# EAGLE design v1 (EAGLE 7.6.0)
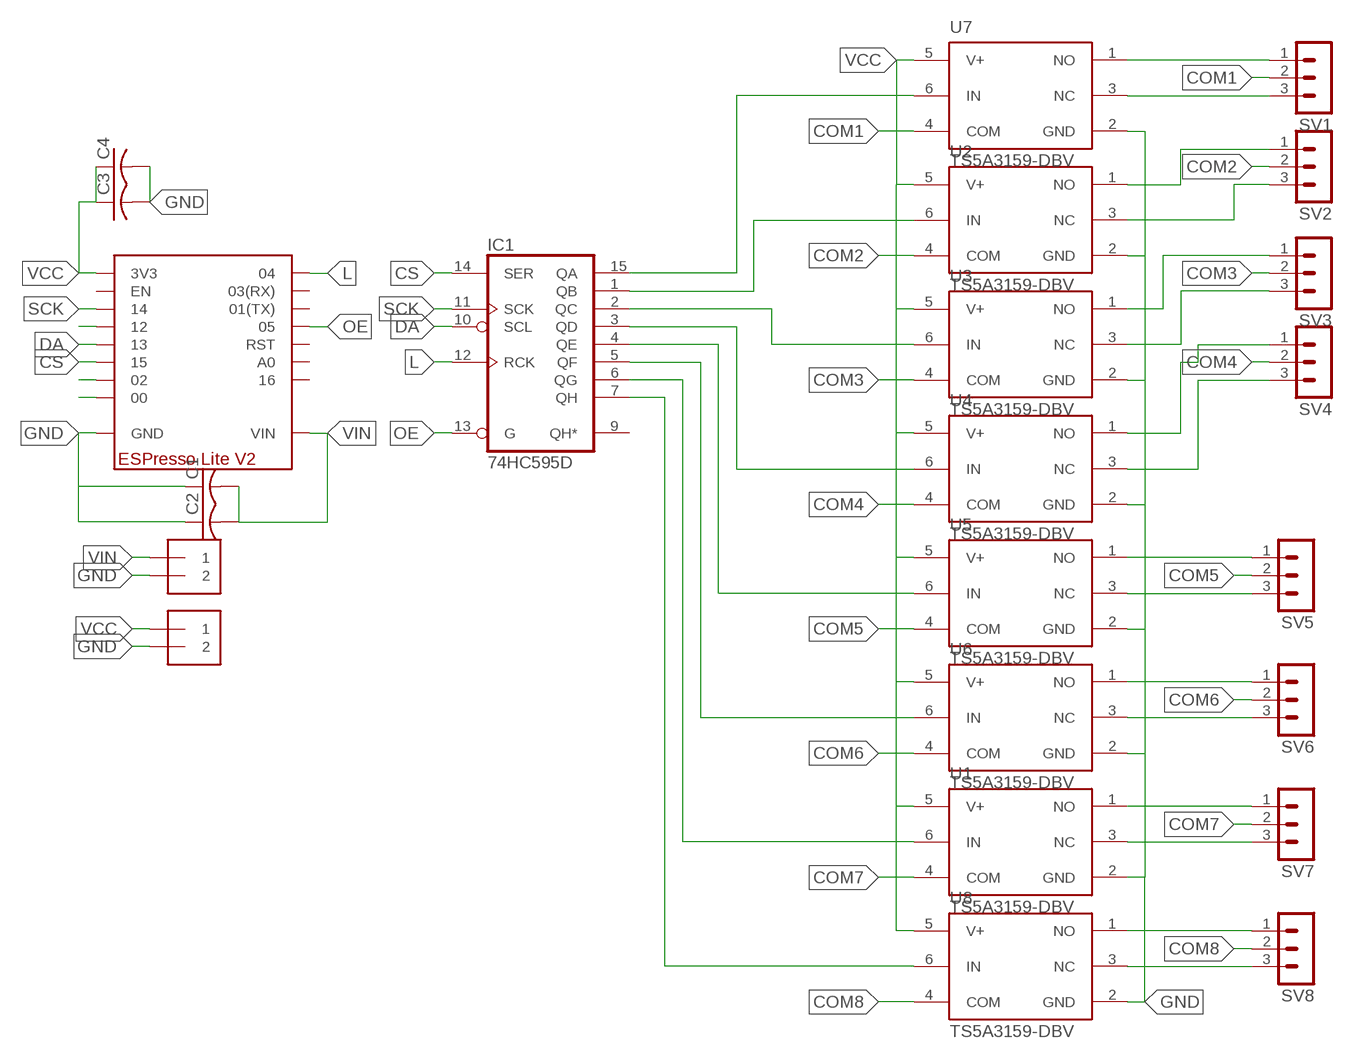
[diagram p0: schematic, sheet 1]

## Parts
C1  C-USC0805  [C0805]
C2  C-USC0805  [C0805]
C3  C-USC0805  [C0805]
C4  C-USC0805  [C0805]
IC1  74HC595D  [SO16]
J1  1X2-3.5MM  [1X2-3.5MM]
J2  1X2-3.5MM  [1X2-3.5MM]
SV1  MA03-1  [MA03-1]
SV2  MA03-1  [MA03-1]
SV3  MA03-1  [MA03-1]
SV4  MA03-1  [MA03-1]
SV5  MA03-1  [MA03-1]
SV6  MA03-1  [MA03-1]
SV7  MA03-1  [MA03-1]
SV8  MA03-1  [MA03-1]
U1  TS5A3159-DBV  [SOT23-6L]
U2  TS5A3159-DBV  [SOT23-6L]
U3  TS5A3159-DBV  [SOT23-6L]
U4  TS5A3159-DBV  [SOT23-6L]
U5  TS5A3159-DBV  [SOT23-6L]
U6  TS5A3159-DBV  [SOT23-6L]
U7  TS5A3159-DBV  [SOT23-6L]
U8  TS5A3159-DBV  [SOT23-6L]
U$1  ESPRESSO-LITE-V2  [ESPRESSO-LITE-V2]

## Nets
COM1: SV1.2 U7.4(COM)
COM2: SV2.2 U2.4(COM)
COM3: SV3.2 U3.4(COM)
COM4: SV4.2 U4.4(COM)
COM5: SV5.2 U5.4(COM)
COM6: SV6.2 U6.4(COM)
COM7: SV7.2 U1.4(COM)
COM8: SV8.2 U8.4(COM)
CS: IC1.14(SER) U$1.15
DA: IC1.10(SCL) U$1.13
GND: C1.1 C2.1 C3.2 C4.2 J1.2 J2.2 U1.2(GND) U2.2(GND) U3.2(GND) U4.2(GND) U5.2(GND) U6.2(GND) U7.2(GND) U8.2(GND) U$1.GND1(GND) U$1.GND2(GND) U$1.GND3(GND)
L: IC1.12(RCK) U$1.04
N$3: SV3.3 U3.3(NC)
N$4: SV1.1 U7.1(NO)
N$5: SV1.3 U7.3(NC)
N$6: SV2.1 U2.1(NO)
N$7: SV2.3 U2.3(NC)
N$8: SV3.1 U3.1(NO)
N$9: SV4.1 U4.1(NO)
N$10: SV4.3 U4.3(NC)
N$11: SV5.1 U5.1(NO)
N$12: SV5.3 U5.3(NC)
N$13: SV6.1 U6.1(NO)
N$14: SV6.3 U6.3(NC)
N$15: SV7.1 U1.1(NO)
N$16: SV7.3 U1.3(NC)
N$17: SV8.1 U8.1(NO)
N$18: SV8.3 U8.3(NC)
N$19: IC1.7(QH) U8.6(IN)
N$20: IC1.6(QG) U1.6(IN)
N$21: IC1.5(QF) U6.6(IN)
N$22: IC1.4(QE) U5.6(IN)
N$23: IC1.3(QD) U4.6(IN)
N$24: IC1.2(QC) U3.6(IN)
N$25: IC1.1(QB) U2.6(IN)
N$26: IC1.15(QA) U7.6(IN)
N$28: U$1.12
N$34: U$1.02
N$35: U$1.00
OE: IC1.13(G) U$1.05
SCK: IC1.11(SCK) U$1.14
VCC: C3.1 C4.1 J2.1 U1.5(V+) U2.5(V+) U3.5(V+) U4.5(V+) U5.5(V+) U6.5(V+) U7.5(V+) U8.5(V+) U$1.3V3
VIN: C1.2 C2.2 J1.1 U$1.VIN1(VIN) U$1.VIN2(VIN)
Unconnected: IC1.9(QH*) U$1.01(01(TX)) U$1.03(03(RX)) U$1.16 U$1.AO(A0) U$1.EN U$1.RST

## Power pins joined to a net without a drawn wire
GND: IC1.8(GND)
VCC: IC1.16(VCC)

## Library data of the parts
C1-C4 = adafruit:C-US: CAPACITOR, American symbol
IC1 = 74xx-eu:74*595: 8-bit SHIFT REGISTER, output latch
J1 J2 = adafruit:1X2: 3.5mm Terminal block http://www.ladyada.net/library/pcb/eaglelibrary.html
SV1-SV8 = con-lstb:MA03-1: PIN HEADER; OC_FARNELL: unknown; OC_NEWARK: unknown
U1-U8 = m-pad-2.1:TS5A3159: Ti's TS5A3159 1 Ohm single-pole double-throw (SPDT) analog switch Description: The TS5A3159 is a single-pole double-throw (SPDT) analog switch that is designed to operate from 1.65 V to 5.5 V. The device offers a low ON-state resistance and an excellent ON-resistance, matching with the break-before-make feature to prevent signal distortion during the transferring of a signal from one channel to another. The device has an excellent total harmonic distortion (THD) performance and consumes very low power. These features make this device suitable for portable audio applications. Features: Specified Break-Before-Make Switching Low ON-State Resistance (1 ) Control Inputs Are 5-V Tolerant Low Charge Injection Excellent ON-Resistance Matching Low Total Harmonic Distortion 1.65-V to 5.5-V Single-Supply Operation Latch-Up Performance Exceeds 100 mA Per JESD 78, Class II ESD Performance Tested Per JESD 22 - 2000-V Human-Body Model (A114-B, Class II) - 1000-V Charged-Device Model (C101) Applications: Cell Phones PDAs Portable Instrumentation Please send any comments to: messi@users.sourceforge.net
U$1 = cmmc_lbr1:ESPRESSO-LITE-V2

## Board
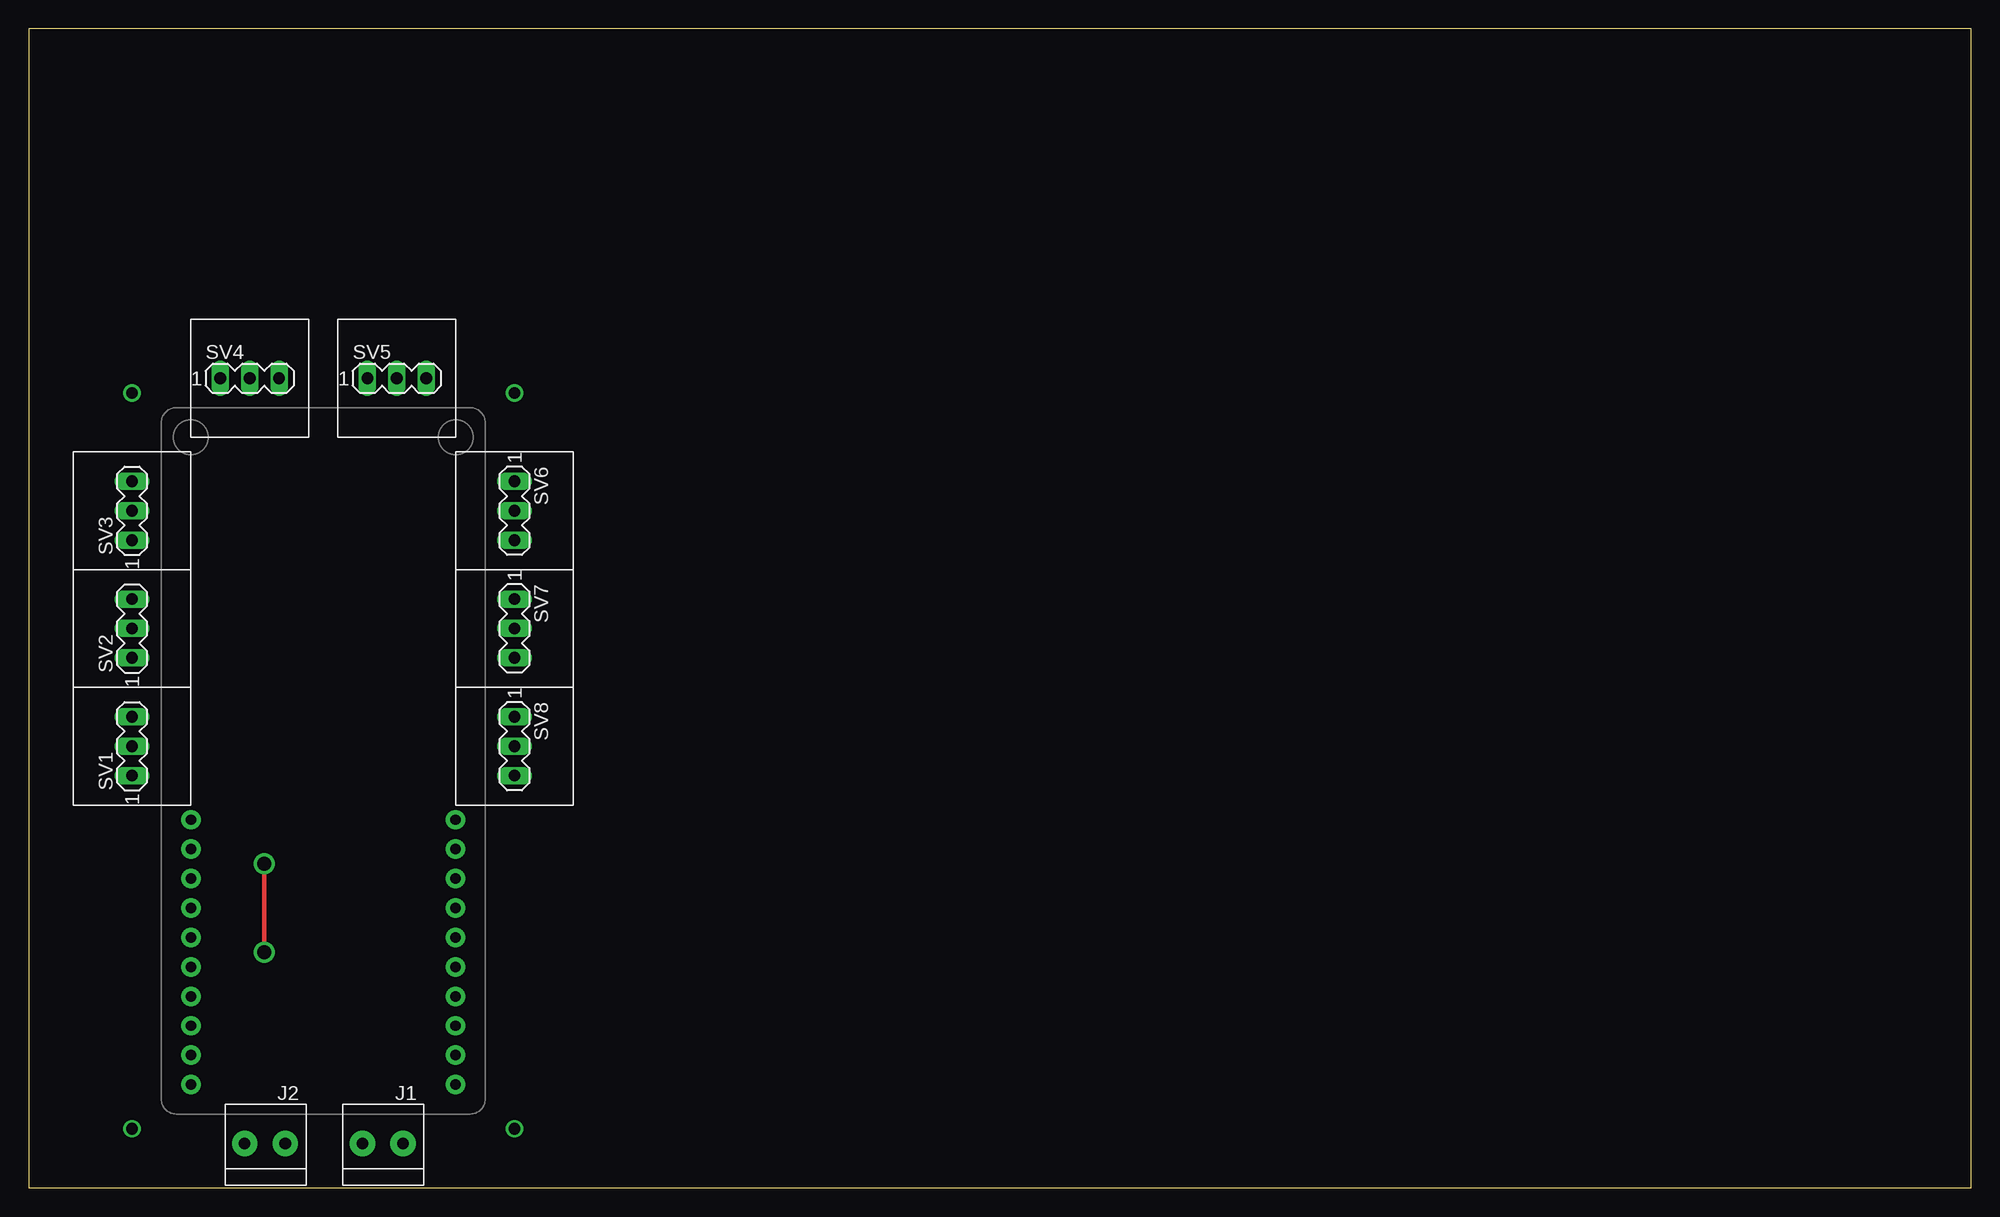
[diagram p1: board, top side]
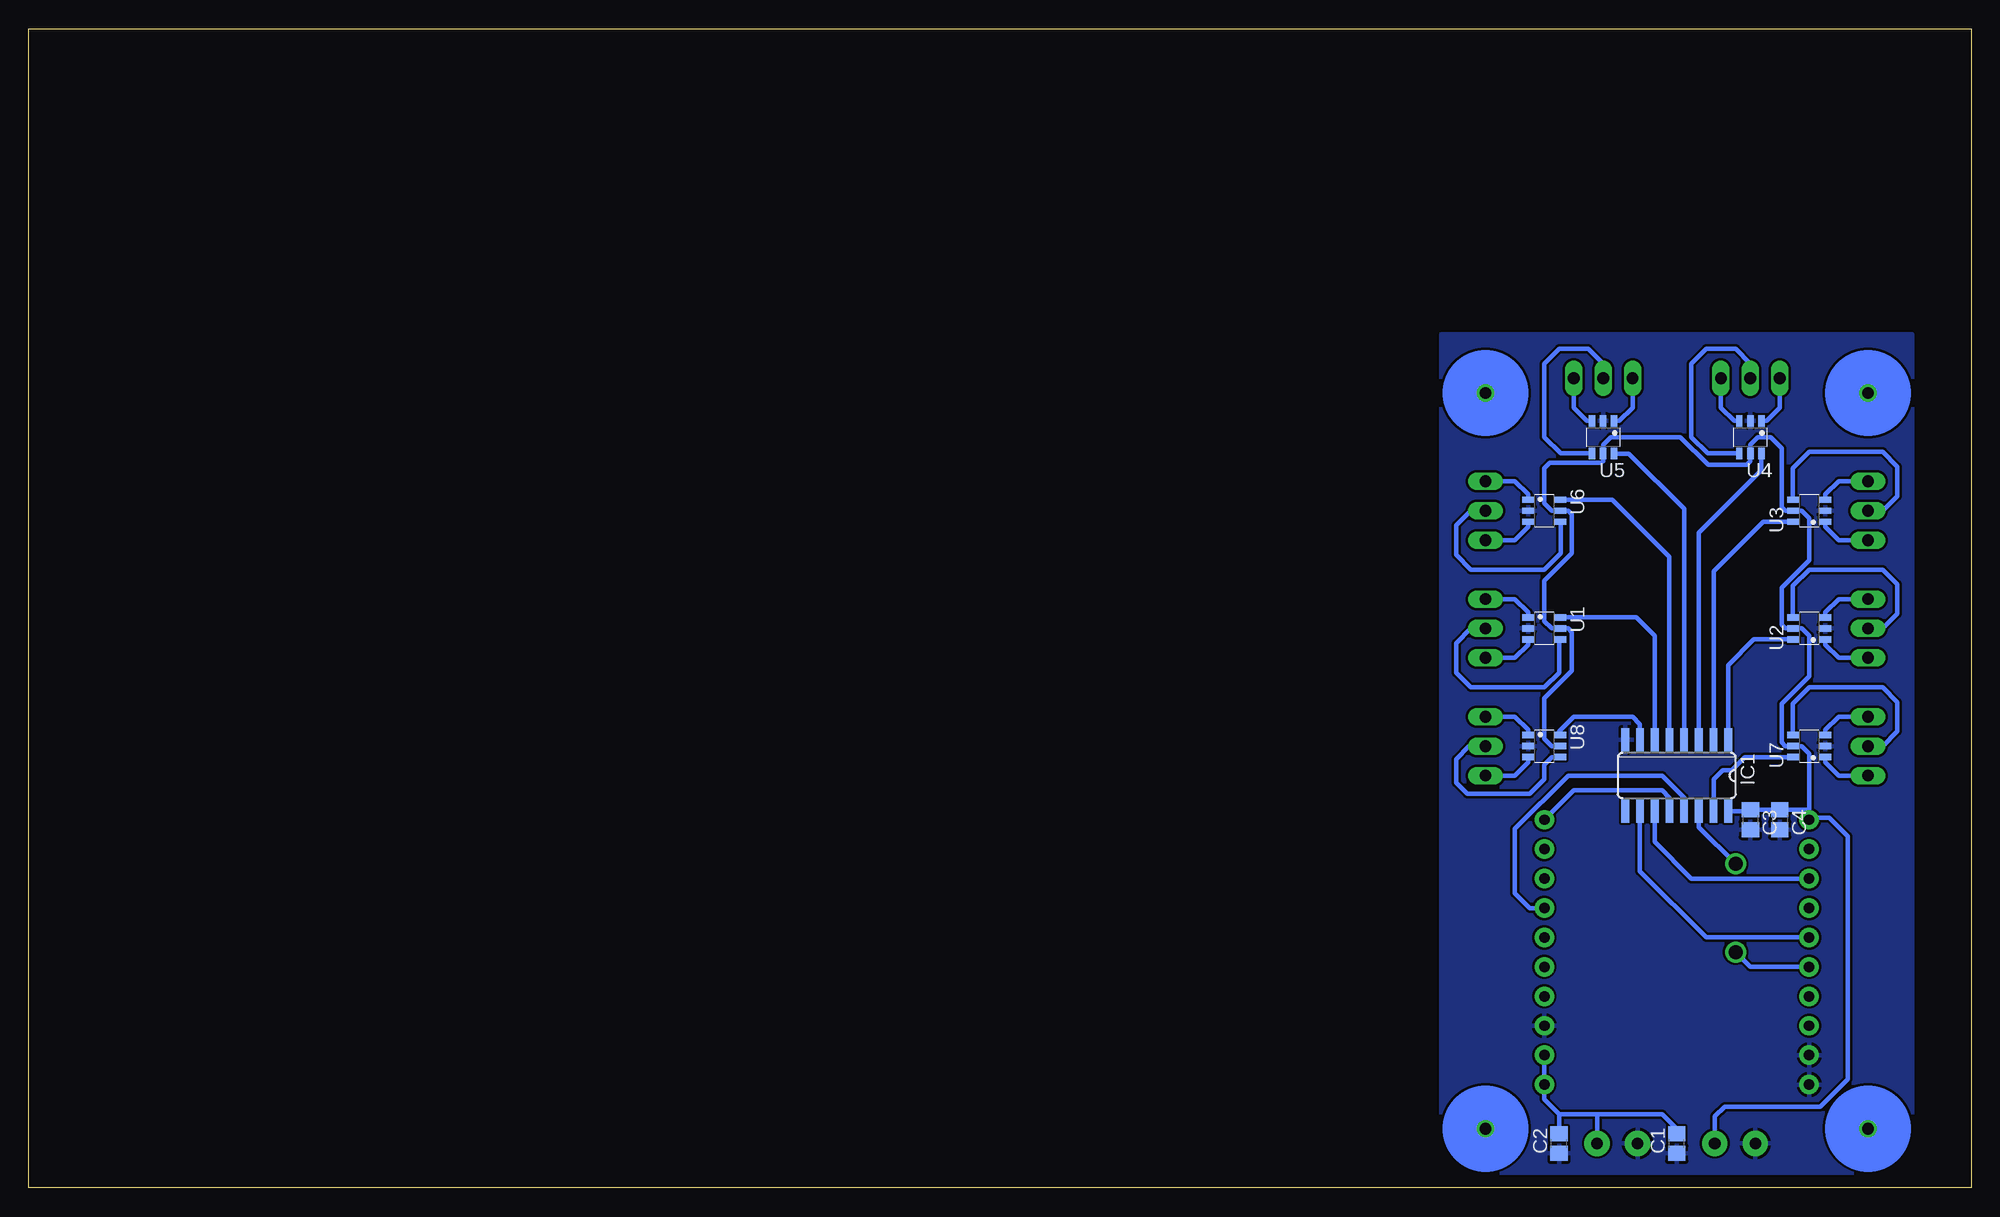
[diagram p2: board, bottom side, seen from below]

Size 167.62 x 100 mm. Coordinates in mm from the lower left corner, seen from the top.
Outline: 0,0 167.62,0 167.62,100 0,100 0,0
Copper layers (1*16): Top 0.035mm / dielectric 1.5mm / Bottom 0.035mm
Design rules "default": minimum track width 10mil, minimum drill 24mil, track to track 8mil, track to pad 8mil, pad to pad 8mil, via to via 8mil, smd to smd 8mil, copper to edge 40mil, drill to drill 8mil, minimum pad ring 10mil, minimum via ring 8mil, stop-mask expansion 4mil, vias tented up to drill 0mil, thermal gap 10mil

### Footprints (pad centres in the part's own frame; a part is rotated, then mirrored left to right if it is on the bottom)
C0805 = smd 1.3 x 1.5: 1 -0.85,0; 2 0.85,0
SO16 = smd 0.66 x 2.032: 1 -4.445,-3.073; 2 -3.175,-3.073; 3 -1.905,-3.073; 4 -0.635,-3.073; 5 0.635,-3.073; 6 1.905,-3.073; 7 3.175,-3.073; 8 4.445,-3.073; 9 4.445,3.073; 10 3.175,3.073; 11 1.905,3.073; 12 0.635,3.073; 13 -0.635,3.073; 14 -1.905,3.073; 15 -3.175,3.073; 16 -4.445,3.073
1X2-3.5MM = drill 1 pad 2.184: 1 1.8,0; 2 -1.7,0
MA03-1 = drill 1.016 long: 1 -2.54,0; 2 0,0; 3 2.54,0
SOT23-6L = smd 0.55 x 1: 1 -0.95,-1.4; 2 0,-1.4; 3 0.95,-1.4; 4 0.95,1.4; 5 0,1.4; 6 -0.95,1.4
ESPRESSO-LITE-V2 = drill 0.9 pad 1.676: 00 2.54,7.62; 01 25.4,20.32; 02 2.54,10.16; 03 25.4,22.86; 3V3 2.54,25.4; 04 25.4,25.4; 05 25.4,17.78; 12 2.54,17.78; 13 2.54,15.24; 14 2.54,20.32; 15 2.54,12.7; 16 25.4,10.16; AO 25.4,12.7; EN 2.54,22.86; GND1 2.54,2.54; GND2 2.54,5.08; GND3 25.4,7.62; RST 25.4,15.24; VIN1 25.4,2.54; VIN2 25.4,5.08

### Placement (x,y rotation side)
C1  25.4,3.81 90 bottom
C2  35.56,3.81 90 bottom
C3  19.05,31.75 270 bottom
C4  16.51,31.75 270 bottom
IC1  25.4,35.56 180 bottom
J1  30.48,3.81 0 top
J2  20.32,3.81 0 top
SV1  8.89,38.1 90 top
SV2  8.89,48.26 90 top
SV3  8.89,58.42 90 top
SV4  19.05,69.85 0 top
SV5  31.75,69.85 0 top
SV6  41.91,58.42 270 top
SV7  41.91,48.26 270 top
SV8  41.91,38.1 270 top
U1  36.83,48.26 270 bottom
U2  13.97,48.26 90 bottom
U3  13.97,58.42 90 bottom
U4  19.05,64.77 180 bottom
U5  31.75,64.77 180 bottom
U6  36.83,58.42 270 bottom
U7  13.97,38.1 90 bottom
U8  36.83,38.1 270 bottom
U$1  11.43,6.35 0 top

### Tracks (layer width: path | path; a pad name or v marks a point on that pad's centre or on a via)
COM1
  Bottom 0.406: U7.4 15.37,41.78 13.97,43.18 7.62,43.18 6.35,41.91 6.35,39.37 7.62,38.1 SV1.2
COM2
  Bottom 0.406: U2.4 15.37,51.94 13.97,53.34 7.62,53.34 6.35,52.07 6.35,49.53 7.62,48.26 SV2.2
COM3
  Bottom 0.406: U3.4 15.37,62.1 13.97,63.5 7.62,63.5 6.35,62.23 6.35,59.69 7.62,58.42 SV3.2
COM4
  Bottom 0.406: U4.4 22.73,63.37 24.13,64.77 24.13,71.12 22.86,72.39 20.32,72.39 19.05,71.12 SV4.2
COM5
  Bottom 0.406: U5.4 35.43,63.37 36.83,64.77 36.83,71.12 35.56,72.39 33.02,72.39 31.75,71.12 SV5.2
COM6
  Bottom 0.406: U6.4 35.43,54.74 36.83,53.34 43.18,53.34 44.45,54.61 44.45,57.15 43.18,58.42 SV6.2
COM7
  Bottom 0.406: SV7.2 43.18,48.26 44.45,46.99 44.45,44.45 43.18,43.18 36.83,43.18 35.56,44.45 35.56,47.18 U1.4
COM8
  Bottom 0.406: U8.4 36.19,37.15 36.83,36.51 36.83,35.24 38.1,33.97 43.5,33.97 44.45,34.92 44.45,36.99 43.34,38.1 SV8.2
CS  (via drill 1.2)
  Top 0.406: v20.32,27.94 v20.32,20.32
  Bottom 0.406: IC1.14 23.5,31.11 v20.32,27.94 | U$1.15 19.05,19.05 v20.32,20.32
DA
  Bottom 0.406: IC1.10 28.57,27.3 22.86,21.59 U$1.13
GND
  pour Bottom: 5.08,1.27 5.08,73.66 45.72,73.66 45.72,1.27
L
  Bottom 0.406: IC1.12 26.04,33.66 26.67,34.29 34.29,34.29 U$1.04
N$3
  Bottom 0.406: U3.3 12.57,59.82 11.43,60.96 SV3.3
N$4
  Bottom 0.406: U7.1 12.57,36.7 11.43,35.56 SV1.1
N$5
  Bottom 0.406: U7.3 12.57,39.5 11.43,40.64 SV1.3
N$6
  Bottom 0.406: U2.1 12.57,46.86 11.43,45.72 SV2.1
N$7
  Bottom 0.406: U2.3 12.57,49.66 11.43,50.8 SV2.3
N$8
  Bottom 0.406: U3.1 12.57,57.02 11.43,55.88 SV3.1
N$9
  Bottom 0.406: U4.1 17.65,66.17 16.51,67.31 SV4.1
N$10
  Bottom 0.406: U4.3 20.45,66.17 21.59,67.31 SV4.3
N$11
  Bottom 0.406: U5.1 30.35,66.17 29.21,67.31 SV5.1
N$12
  Bottom 0.406: U5.3 33.15,66.17 34.29,67.31 SV5.3
N$13
  Bottom 0.406: U6.1 38.23,59.82 39.37,60.96 SV6.1
N$14
  Bottom 0.406: U6.3 38.23,57.02 39.37,55.88 SV6.3
N$15
  Bottom 0.406: U1.1 38.23,49.66 39.37,50.8 SV7.1
N$16
  Bottom 0.406: U1.3 38.23,46.86 39.37,45.72 SV7.3
N$17
  Bottom 0.406: U8.1 38.23,39.5 39.37,40.64 SV8.1
N$18
  Bottom 0.406: U8.3 38.23,36.7 39.37,35.56 SV8.3
N$19
  Bottom 0.406: IC1.7 28.57,40.01 29.21,40.64 34.29,40.64 35.56,39.37 35.56,39.18 U8.6
N$20
  Bottom 0.406: U1.6 28.89,49.21 27.3,47.62 IC1.6
N$21
  Bottom 0.406: IC1.5 26.04,54.45 30.96,59.37 U6.6
N$22
  Bottom 0.406: IC1.4 24.77,58.58 29.53,63.34 30.77,63.34 U5.6
N$23
  Bottom 0.406: IC1.3 23.5,56.52 18.1,61.91 U4.6
N$24
  Bottom 0.406: IC1.2 22.23,53.18 17.94,57.47 U3.6
N$25
  Bottom 0.406: IC1.1 20.96,45.09 18.73,47.31 U2.6
N$26
  Bottom 0.406: U7.6 19.52,37.15 20.64,36.04 21.43,36.04 22.23,35.24 IC1.15
N$27  (via drill 1)
  other vias: 41.91,5.08
N$29  (via drill 1)
  other vias: 8.89,5.08
N$30  (via drill 1)
  other vias: 41.91,68.58
N$31  (via drill 1)
  other vias: 8.89,68.58
OE
  Bottom 0.406: IC1.13 24.77,33.66 26.67,35.56 34.77,35.56 39.37,30.96 39.37,25.4 38.1,24.13 U$1.05
SCK
  Bottom 0.406: IC1.11 27.3,29.84 24.13,26.67 U$1.14
VCC
  Bottom 0.406: U8.5 36.2,38.1 36.83,38.73 36.83,42.23 34.45,44.61 34.45,47.94 34.77,48.26 U1.5 36.2,48.26 36.83,48.9 36.83,52.39 34.45,54.77 34.45,58.1 34.77,58.42 U6.5 36.2,58.42 36.83,59.05 36.83,62.07 36.35,62.55 31.91,62.55 31.75,62.71 U5.5 31.75,64.14 31.12,64.77 25.08,64.77 22.7,62.39 19.37,62.39 19.05,62.71 U4.5 19.05,64.14 18.41,64.77 17.3,64.77 16.35,63.82 16.35,58.74 16.03,58.42 U3.5 14.61,58.42 13.97,57.78 13.97,54.13 16.35,51.75 16.35,48.58 16.03,48.26 U2.5 14.61,48.26 13.97,47.62 13.97,44.13 16.35,41.75 16.35,38.42 16.03,38.1 U7.5 14.61,38.1 13.97,37.47 13.97,32.54 | 13.97,32.54 U$1.3V3 13.81,31.91 12.22,31.91 10.64,30.32 10.64,9.37 13.02,6.99 21.27,6.99 22.12,6.14 J2.1 | IC1.16 19.16,32.49 C3.1 C4.1 14.03,32.6 13.97,32.54
VIN
  Bottom 0.406: C1.2 25.4,5.08 26.67,6.35 31.75,6.35 32.28,6.35 | 35.56,6.35 36.83,7.62 U$1.VIN1 U$1.VIN2 | C2.2 35.56,6.35 | 35.56,6.35 32.28,6.35 | J1.1 32.28,6.35
(copper drawn outside any net)
  shapes: Bottom circle x5